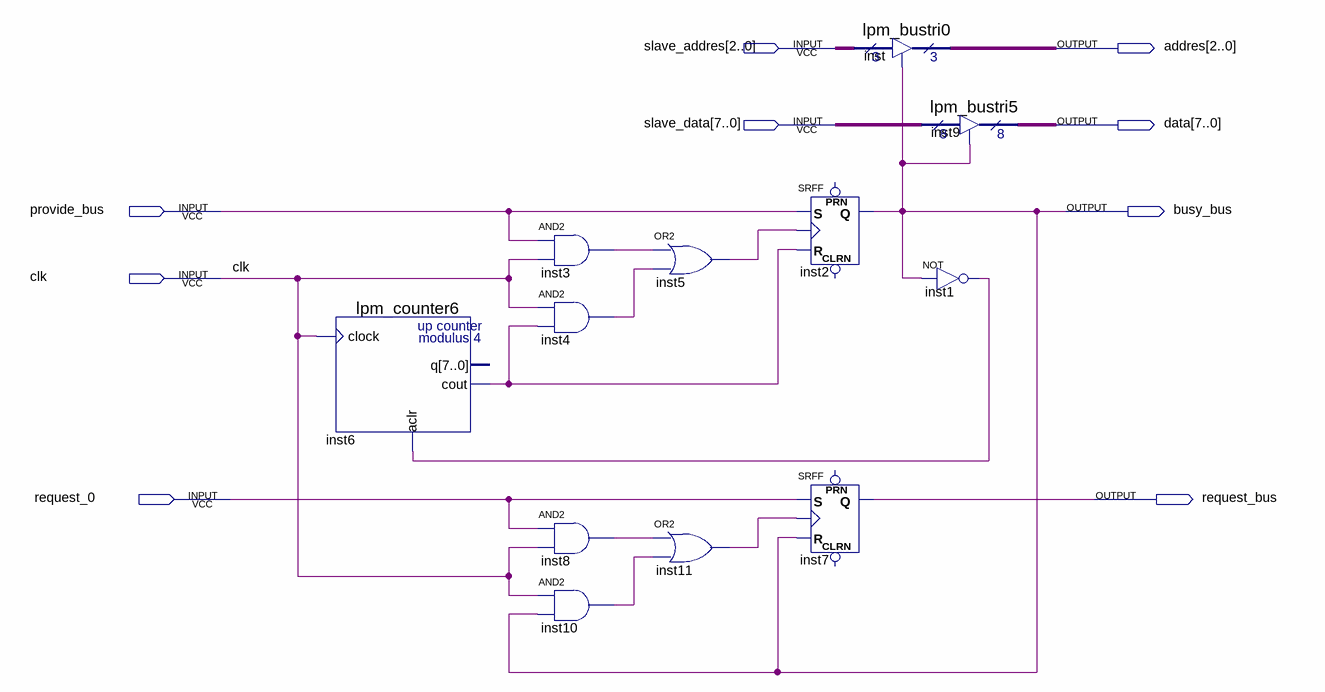
[diagram p0: schematic sheet]
// Quartus schematic master.bdf as structural Verilog: 12 symbols, 9 pins
module master (
  input  [2:0] slave_addres,
  input  [7:0] slave_data,
  input  provide_bus,
  input  clk,
  input  request_0,
  output [2:0] addres,
  output [7:0] data,
  output busy_bus,
  output request_bus
);

  wire inst1_out, inst3_out, inst4_out, inst5_out, inst6_cout, inst8_out, inst10_out, inst11_out;

  lpm_counter6 inst6 (.clock(clk), .aclr(inst1_out), .cout(inst6_cout));  // open: q
  and inst3 (inst3_out, provide_bus, clk);
  and inst4 (inst4_out, clk, inst6_cout);
  and inst8 (inst8_out, request_0, clk);
  and inst10 (inst10_out, clk, busy_bus);
  or inst5 (inst5_out, inst3_out, inst4_out);
  or inst11 (inst11_out, inst8_out, inst10_out);
  SRFF inst2 (.S(provide_bus), .R(inst6_cout), .CLK(inst5_out), .Q(busy_bus));  // open: PRN, CLRN
  SRFF inst7 (.S(request_0), .R(busy_bus), .CLK(inst11_out), .Q(request_bus));  // open: PRN, CLRN
  lpm_bustri0 inst (.enabledt(busy_bus), .data(slave_addres), .tridata(addres));
  lpm_bustri5 inst9 (.enabledt(busy_bus), .data(slave_data), .tridata(data));
  not inst1 (inst1_out, busy_bus);
endmodule
